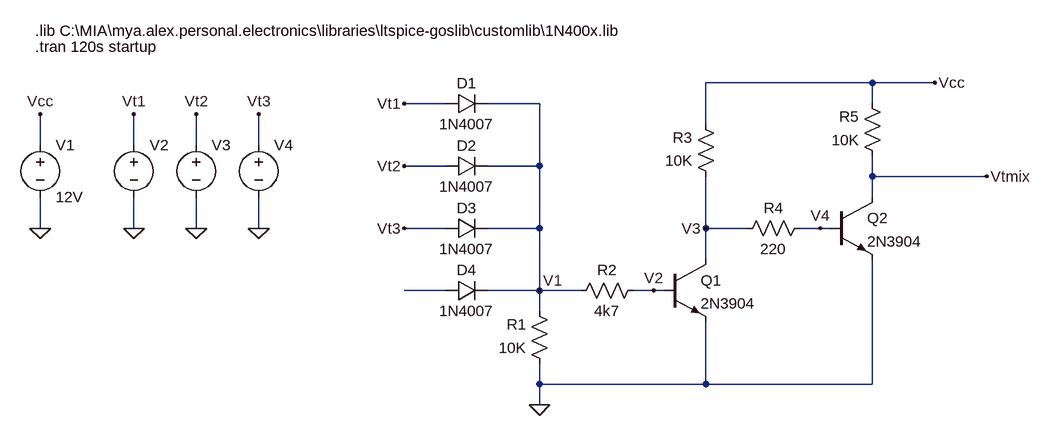
[diagram p0: schematic phase-triggers-mixer.asc]
phase-triggers-mixer.asc, the LTspice schematic file:
Version 4
SHEET 1 1284 680
WIRE 1024 -96 768 -96
WIRE 1120 -96 1024 -96
WIRE 368 -64 304 -64
WIRE 512 -64 432 -64
WIRE 1024 -64 1024 -96
WIRE 768 -32 768 -96
WIRE -256 0 -256 -48
WIRE -112 0 -112 -48
WIRE -16 0 -16 -48
WIRE 80 0 80 -48
WIRE 368 32 304 32
WIRE 512 32 512 -64
WIRE 512 32 432 32
WIRE 1024 48 1024 16
WIRE 1200 48 1024 48
WIRE 1024 80 1024 48
WIRE -256 128 -256 80
WIRE -112 128 -112 80
WIRE -16 128 -16 80
WIRE 80 128 80 80
WIRE 368 128 304 128
WIRE 512 128 512 32
WIRE 512 128 432 128
WIRE 768 128 768 48
WIRE 832 128 768 128
WIRE 944 128 912 128
WIRE 960 128 944 128
WIRE 768 176 768 128
WIRE 368 224 304 224
WIRE 512 224 512 128
WIRE 512 224 432 224
WIRE 576 224 512 224
WIRE 688 224 656 224
WIRE 704 224 688 224
WIRE 512 256 512 224
WIRE 512 368 512 336
WIRE 768 368 768 272
WIRE 768 368 512 368
WIRE 1024 368 1024 176
WIRE 1024 368 768 368
WIRE 512 400 512 368
FLAG -256 128 0
FLAG -256 -48 Vcc
FLAG -112 128 0
FLAG -112 -48 Vt1
FLAG 1120 -96 Vcc
FLAG 304 -64 Vt1
FLAG 512 400 0
FLAG 1200 48 Vtmix
FLAG 512 224 V1
FLAG 688 224 V2
FLAG 768 128 V3
FLAG -16 128 0
FLAG -16 -48 Vt2
FLAG 304 32 Vt2
FLAG 80 128 0
FLAG 80 -48 Vt3
FLAG 304 128 Vt3
FLAG 944 128 V4
SYMBOL voltage -256 -16 R0
WINDOW 123 0 0 Left 0
WINDOW 39 0 0 Left 0
SYMATTR InstName V1
SYMATTR Value 12V
SYMBOL voltage -112 -16 R0
WINDOW 123 0 0 Left 0
WINDOW 39 0 0 Left 0
WINDOW 3 24 96 Invisible 2
SYMATTR Value PULSE(0 8 1s 1u 1u 12s 40s 5)
SYMATTR InstName V2
SYMBOL diode 368 -48 R270
WINDOW 0 32 32 VTop 2
WINDOW 3 0 32 VBottom 2
SYMATTR InstName D1
SYMATTR Value 1N4007
SYMBOL diode 368 48 R270
WINDOW 0 32 32 VTop 2
WINDOW 3 0 32 VBottom 2
SYMATTR InstName D2
SYMATTR Value 1N4007
SYMBOL diode 368 144 R270
WINDOW 0 32 32 VTop 2
WINDOW 3 0 32 VBottom 2
SYMATTR InstName D3
SYMATTR Value 1N4007
SYMBOL diode 368 240 R270
WINDOW 0 32 32 VTop 2
WINDOW 3 0 32 VBottom 2
SYMATTR InstName D4
SYMATTR Value 1N4007
SYMBOL res 528 352 R180
WINDOW 0 36 76 Left 2
WINDOW 3 36 40 Left 2
SYMATTR InstName R1
SYMATTR Value 10K
SYMBOL res 560 240 R270
WINDOW 0 32 56 VTop 2
WINDOW 3 0 56 VBottom 2
SYMATTR InstName R2
SYMATTR Value 4k7
SYMBOL npn 704 176 R0
SYMATTR InstName Q1
SYMATTR Value 2N3904
SYMBOL npn 960 80 R0
SYMATTR InstName Q2
SYMATTR Value 2N3904
SYMBOL res 784 64 R180
WINDOW 0 36 76 Left 2
WINDOW 3 36 40 Left 2
SYMATTR InstName R3
SYMATTR Value 10K
SYMBOL res 1040 32 R180
WINDOW 0 36 76 Left 2
WINDOW 3 36 40 Left 2
SYMATTR InstName R5
SYMATTR Value 10K
SYMBOL voltage -16 -16 R0
WINDOW 123 0 0 Left 0
WINDOW 39 0 0 Left 0
WINDOW 3 24 96 Invisible 2
SYMATTR Value PULSE(0 8 10s 1u 1u 20s 40s 5)
SYMATTR InstName V3
SYMBOL voltage 80 -16 R0
WINDOW 123 0 0 Left 0
WINDOW 39 0 0 Left 0
WINDOW 3 24 96 Invisible 2
SYMATTR Value PULSE(0 8 12s 1u 1u 10s 40s 5)
SYMATTR InstName V4
SYMBOL res 816 144 R270
WINDOW 0 32 56 VTop 2
WINDOW 3 0 56 VBottom 2
SYMATTR InstName R4
SYMATTR Value 220
TEXT -264 -152 Left 2 !.tran 120s startup
TEXT -264 -176 Left 2 !.lib C:\\MIA\\mya.alex.personal.electronics\\libraries\\ltspice-goslib\\customlib\\1N400x.lib

The netlist it stands for:
* phase-triggers-mixer.asc
V1 Vcc 0 12V
V2 Vt1 0 PULSE(0 8 1s 1u 1u 12s 40s 5)
D1 Vt1 V1 1N4007
D2 Vt2 V1 1N4007
D3 Vt3 V1 1N4007
D4 N001 V1 1N4007
R1 0 V1 10K
R2 V1 V2 4k7
Q1 V3 V2 0 0 2N3904
Q2 Vtmix V4 0 0 2N3904
R3 V3 Vcc 10K
R5 Vtmix Vcc 10K
V3 Vt2 0 PULSE(0 8 10s 1u 1u 20s 40s 5)
V4 Vt3 0 PULSE(0 8 12s 1u 1u 10s 40s 5)
R4 V3 V4 220
.model D D
.lib standard.dio
.model NPN NPN
.model PNP PNP
.lib standard.bjt
.tran 120s startup
.lib C:\MIA\mya.alex.personal.electronics\libraries\ltspice-goslib\customlib\1N400x.lib
.backanno
.end